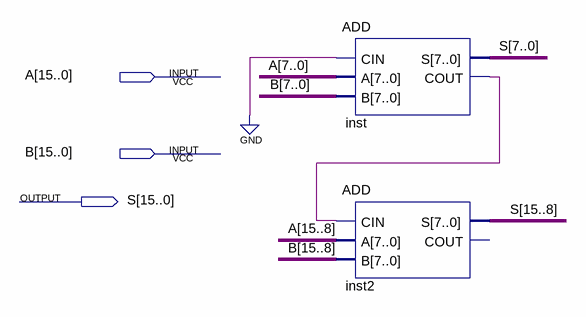
[diagram p0: schematic sheet]
// Quartus schematic ADD16bit.bdf as structural Verilog: 2 symbols, 3 pins
module ADD16bit (
  input  [15:0] A,
  input  [15:0] B,
  output [15:0] S
);

  wire inst_cout;

  ADD inst (.CIN(1'b0), .A(A[7:0]), .B(B[7:0]), .S(S[7:0]), .COUT(inst_cout));
  ADD inst2 (.CIN(inst_cout), .A(A[15:8]), .B(B[15:8]), .S(S[15:8]));  // open: COUT
endmodule
